# Altium schematic sheet USB.SchDoc
size A3; SheetNumber: 7; SheetTotal: 8; DocumentSheetName: USB Type-C UFP
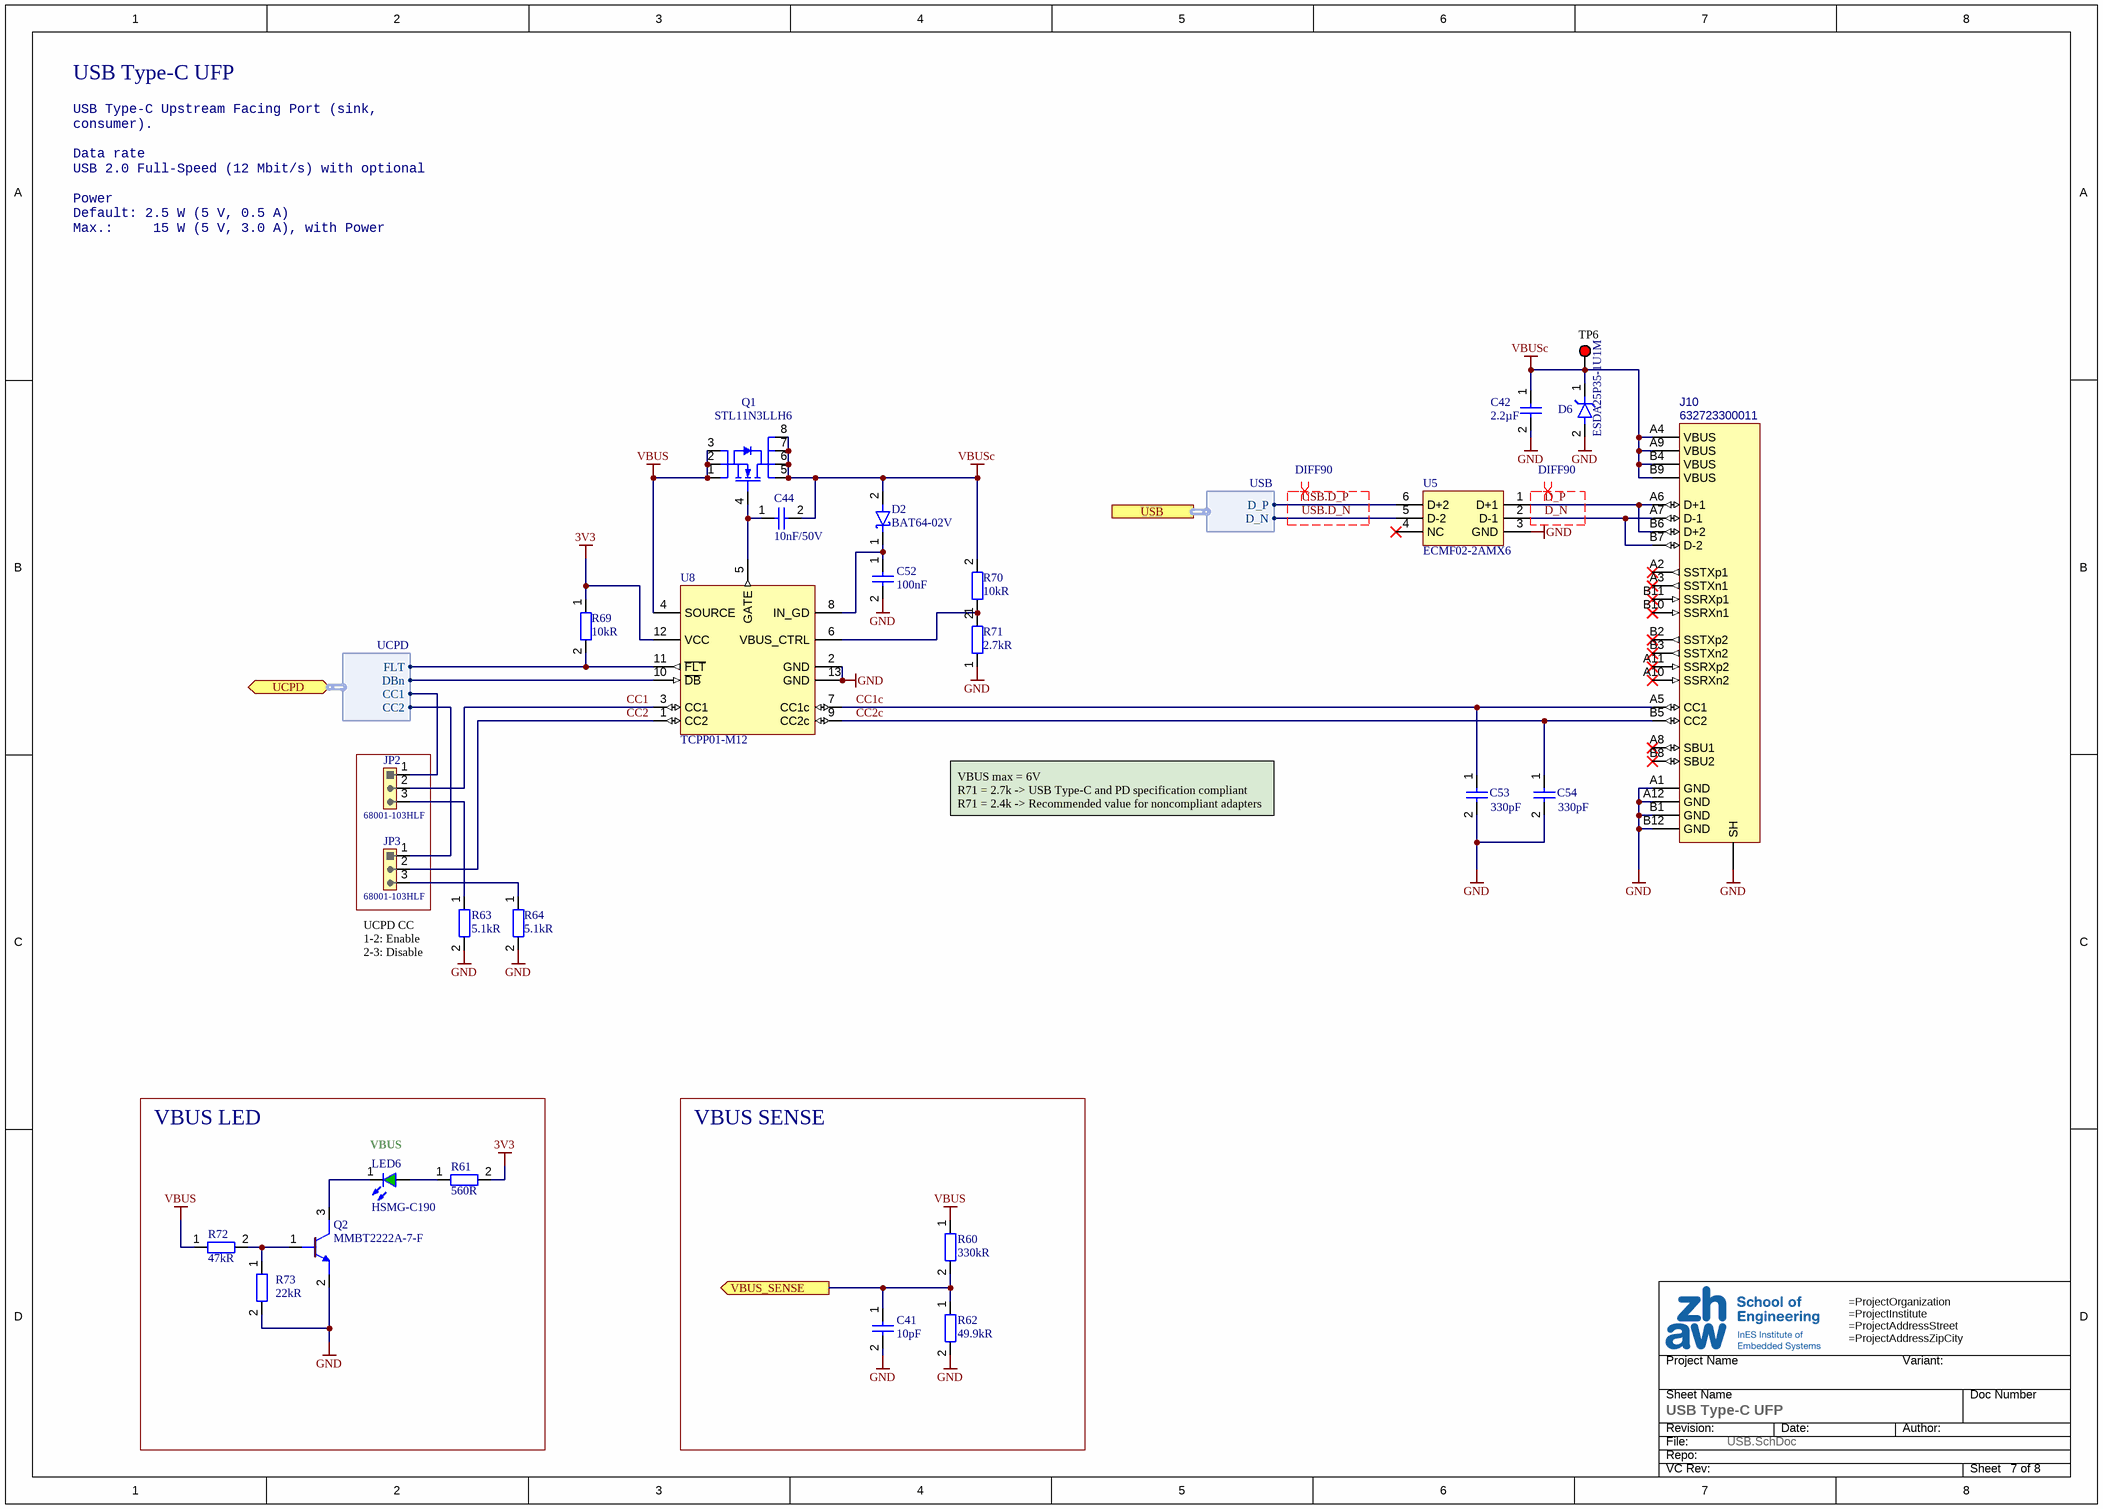
[diagram p0: USB.SchDoc]

## Parts
C41  value 10pF  [CAPC1608X80N]  (hidden comment: 10pF/50V)
C42  value 2.2µF  [CAPC1608X80N]  (hidden comment: 2.2uF/10V)
C44  10nF/50V  [CAPC1005X50N]
C52  value 100nF  [CAPC1608X80N]  (hidden comment: 100nF/50V)
C53  value 330pF  [CAPC1005X50N]  (hidden comment: 330pF/50V)
C54  value 330pF  [CAPC1005X50N]  (hidden comment: 330pF/50V)
D2  BAT64-02V  [SODFL160X65-2N]
D6  ESDA25P35-1U1M  [DFN110P160X60-2L]
J10  632723300011  [WE_632723300011]
JP2  68001-103HLF  [HD254_1x3_MV]
JP3  68001-103HLF  [HD254_1x3_MV]
LED6  HSMG-C190  [LEDSC160X80X80-2Lgn]
Q1  STL11N3LLH6  [PowerFLAT65P300X315X80-8+1]
Q2  MMBT2222A-7-F  [SOT95P235X120-3N]
R60  330kR  [RESC1608X45N]
R61  560R  [RESC1608X45N]
R62  49.9kR  [RESC1608X45N]
R63  5.1kR  [RESC1005X35N]
R64  5.1kR  [RESC1005X35N]
R69  10kR  [RESC1005X35N]
R70  10kR  [RESC1005X35N]
R71  2.7kR  [RESC1005X35N]
R72  47kR  [RESC1608X45N]
R73  22kR  [RESC1608X45N]
TP6  5000  [KSTN-5000]  (value not drawn)
U5  ECMF02-2AMX6  [QFN50P150X170X50-6N]
U8  TCPP01-M12  [QFN50P300X300X100-13T145X145N]

## Blocks framed on the sheet
VBUS LED: LED6 Q2 R61 R72 R73
VBUS SENSE: C41 R60 R62

## Ports
UCPD (bidir, harness UCPD), USB (harness USB), VBUS_SENSE (out)

## Harnesses
USB: D_P, D_N
UCPD: CC1, CC2, DBn, FLT

## Nets
3V3: R61.2 R69.1 U8.12(VCC)
GND: C41.2 C42.2 C52.2 C53.2 C54.2 D6.2(A) J10.A1(GND) J10.A12(GND) J10.B1(GND) J10.B12(GND) J10.SH Q2.2(E) R62.2 R63.2 R64.2 R71.1 R73.2 U5.3(GND) U8.2(GND) U8.13(GND)
VBUS: Q1.1(S) Q1.2(S) Q1.3(S) R60.1 R72.1 U8.4(SOURCE)
VBUSc: C42.1 C44.2 D2.2(Anode) D6.1(A) J10.A4(VBUS) J10.A9(VBUS) J10.B4(VBUS) J10.B9(VBUS) Q1.5(D) Q1.6(D) Q1.7(D) Q1.8(D) R70.2 TP6.1
CC1: JP2.2 U8.3(CC1)
CC1c: C53.1 J10.A5(CC1) U8.7(CC1c)
CC2: JP3.2 U8.1(CC2)
CC2c: C54.1 J10.B5(CC2) U8.9(CC2c)
D_N: J10.A7(D-1) J10.B7(D-2) U5.2(D-1)
D_P: J10.A6(D+1) J10.B6(D+2) U5.1(D+1)
USB.D_N: U5.5(D-2) ; port USB.D_N
USB.D_P: U5.6(D+2) ; port USB.D_P
VBUS_SENSE: C41.1 R60.2 R62.1 ; port VBUS_SENSE
NetC44_1: C44.1 Q1.4(G) U8.5(GATE)
NetC52_1: C52.1 D2.1(Cathode) U8.8(IN_GD)
NetJP2_1: JP2.1 ; port UCPD.CC1
NetJP2_3: JP2.3 R63.1
NetJP3_1: JP3.1 ; port UCPD.CC2
NetJP3_3: JP3.3 R64.1
NetLED6_1: LED6.1(K) Q2.3(C)
NetLED6_2: LED6.2(A) R61.1
NetQ2_1: Q2.1(B) R72.2 R73.1
NetR69_2: R69.2 U8.11(~{FLT}) ; port UCPD.FLT
NetR70_1: R70.1 R71.2 U8.6(VBUS_CTRL)
NetU8_10: U8.10(~{DB}) ; port UCPD.DBn

Not connected (* = marked no-connect by the designer): J10 A2(SSTXp1)* A3(SSTXn1)* A8(SBU1)* A10(SSRXn2)* A11(SSRXp2)* B2(SSTXp2)* B3(SSTXn2)* B8(SBU2)* B10(SSRXn1)* B11(SSRXp1)*; U5 4(NC)*

## Layout directives
differential pair; differential pair class DIFF90: D_N, D_P, USB.D_N, USB.D_P

## Notes on the sheet
- USB Type-C UFP
- USB Type-C Upstream Facing Port (sink, consumer).
  Data rate
  USB 2.0 Full-Speed (12 Mbit/s) with optional
  Power
  Default: 2.5 W (5 V, 0.5 A)
  Max.:     15 W (5 V, 3.0 A), with Power Delivery (PD)
- VBUS max = 6V
  R71 = 2.7k -> USB Type-C and PD specification compliant
  R71 = 2.4k -> Recommended value for noncompliant adapters
- (near R63) UCPD CC
  1-2: Enable
  2-3: Disable
- (near LED6) VBUS
- Sheet Name
- Project Name
- Variant:
- Doc Number
- File:
- Repo:
- Revision:
- Date:
- Author:
- VC Rev:
- Sheet

## Library data of the parts
C41 = CMP-001-00014-21: Cap MLCC, 10pF, 50V, C0G, 5%, 0603; Type: MLCC; Case/Package: 0603; Voltage Rating: 50V; Case Code (Metric): 1608; Mounting Technology: SMD; Tolerance: 5%; Dielectricum: C0G
C42 = CMP-00353-4: Cap MLCC, 2.2uF, 10V, X7R, 10%, 0603; Case Code (Metric): 1608; Case/Package: 0603; Tolerance: 10%; Mounting Technology: SMD; Type: MLCC; Dielectricum: X7R; Voltage Rating: 10V
C44 = CMP-001-00069-21: Cap MLCC, 10nF, 50V, X7R, 10%, 0402; Tolerance: 10%; Type: MLCC; Voltage Rating: 50V; Case Code (Metric): 1005; Mounting Technology: SMD; Case/Package: 0402; Dielectricum: X7R; Value: 10nF
C52 = CMP-001-00017-21: Cap MLCC, 100nF, 50V, X7R, 10%, 0603; Voltage Rating: 50V; Dielectricum: X7R; Tolerance: 10%; Type: MLCC; Mounting Technology: SMD; Case Code (Metric): 1608; Case/Package: 0603
C53 C54 = CMP-001-00094-19: Cap MLCC, 330pF, 50V, C0G, 5%, 0402; Type: MLCC; Dielectricum: C0G; Voltage Rating: 50V; Case/Package: 0402; Mounting Technology: SMD; Tolerance: 5%; Case Code (Metric): 1005
D2 = CMP-004-00068-26: Schottky Diode, 40V, 250mA, SOD-523FL-2; Type: SOD123; Voltage: 40V; Current: 250mA; Mounting Technology: SMD; Case/Package: SOD-523FL-2
D6 = CMP-004-00023-26: TVS Diode, unidirectional, 22V, 35A, 1400W, 1610 (0603); Peak Power: 1.4kW; Connection: single; Size: L1.6B1H0.55; Peak Current: 35A; Rated Voltage: 22V; Direction: unidirectional; Case Code (Metric): 1610; Case/Package: 0603; Mounting Technology: SMD
J10 = CMP-220-000000-8: USB-C, 24 Pin, Pitch 500um, 20V, Horizontal, SMD/THT, L11.2B8.74H2.96; Manufacturer: Wurth Elektronik; Pitch: 500µm; Max Current: 5A; Gender: Female; Connection: Pluggable; Pin Mapping: 2x12; Family Name: WR-USB Connectors; Mounting Technology: SMD/THT; Angle: Horizontal; Type: USB-C; Pins: 24; Max Voltage: 20V; Size: L11.2B8.74H2.96
JP2 JP3 = CMP-002-00127-12: Header, 1x3 Pin, Pitch 2.54mm, Male, Vertical, THT; Manufacturer: FCI; Mating Length: 5.84mm; Plating: Gold; Overall Contact Length: 11.43mm; Termination Length: 3.05mm; Pitch Row: 2.54mm; Pin Mapping: 1x3; Pins: 3; Mounting Technology: THT; Angle: Vertical; Pitch: 2.54mm; Insulation Height: 2.54mm; Gender: Male
LED6 = CMP-007-00013-24: LED, Green, 20mA, 2.2V, 0603; Case/Package: 0603; Rated Current: 20mA; Forward Voltage: 2.2V; Size: L1.6B0.8H0.8; Color: Green; Mounting Technology: SMD
Q1 = CMP-00725-7: MOSFET N-enh, 30V, 11A, 44Ap, 6mR, 50W, PowerFLAT 3.3 x 3.3; Resistance: 6m; Current peak: 44A; Type: MOSFET; Power: 50W; Case/Package: PowerFLAT 3.3 x 3.3; Mounting Technology: SMD; Current: 11A; Technology: N-enhancement; Voltage: 30V; Size: L3.15B3.0H0.8
Q2 = CMP-013-00084-8: Transistor NPN, 40V, 600mA, 310mW, SOT-23-3; Current: 600mA; Case/Package: SOT-23-3; Voltage: 40V; Power: 310mW; Type: Transistor; Mounting Technology: SMD; Technology: NPN
R60 = CMP-009-00448-5: Res, 330kR, 1%, 0.1W, 0603; Value: 330k; Voltage Rating: 75V; Power: 100mW; Temperature Coefficient: 100ppm; Case/Package: 0603; Type: Fixed; Case Code (Metric): 1608; Tolerance: 1%; Mounting Technology: SMD
R61 = CMP-00862-1: Res, 560R, 1%, 100mW, 0603; Voltage Rating: 75V; Value: 560; Tolerance: 1%; Case/Package: 0603; Mounting Technology: SMD; Type: Fixed; Power: 100mW; Case Code (Metric): 1608
R62 = CMP-00778-2: Res, 49.9kR, 1%, 100mW, 0603; Value: 49.9k; Voltage Rating: 75V; Temperature Coefficient: 100ppm; Case Code (Metric): 1608; Power: 100mW; Case/Package: 0603; Tolerance: 1%; Type: Fixed; Size: L1.6B0.8H0.45; Mounting Technology: SMD
R63 R64 = CMP-009-00255-13: Res, 5.1kR, 1%, 0.063W, 0402; Voltage Rating: 50V; Value: 5.1k; Power: 63mW; Case/Package: 0402; Case Code (Metric): 1005; Tolerance: 1%; Mounting Technology: SMD; Type: Fixed
R69 R70 = CMP-009-00298-12: Res, 10kR, 1%, 0.063W, 0402; Value: 10k; Power: 63mW; Voltage Rating: 50V; Tolerance: 1%; Type: Fixed; Case Code (Metric): 1005; Case/Package: 0402; Mounting Technology: SMD
R71 = CMP-009-00214-21: Res, 2.7kR, 1%, 0.063W, 0402; Value: 2.7k; Power: 63mW; Voltage Rating: 50V; Type: Fixed; Mounting Technology: SMD; Case/Package: 0402; Case Code (Metric): 1005; Tolerance: 1%
R72 = CMP-009-00436-5: Res, 47kR, 1%, 0.1W, 0603; Voltage Rating: 75V; Temperature Coefficient: 100ppm/°C; Power: 100mW; Value: 47k; Case/Package: 0603; Case Code (Metric): 1608; Mounting Technology: SMD; Type: Fixed; Tolerance: 1%
R73 = CMP-009-00438-5: Res, 22kR, 1%, 0.1W, 0603; Voltage Rating: 75V; Temperature Coefficient: 100ppm; Value: 22k; Power: 100mW; Tolerance: 1%; Case Code (Metric): 1608; Mounting Technology: SMD; Type: Fixed; Case/Package: 0603
TP6 = CMP-00067-9: Test Point, Red, D2.5H4.6, THT, closed ring D1.25; Mounting Technology: THT; Color: Red; Size: D2.5H4.6
U5 = CMP-00721-6: ESD Common Mode Filter, Diodes and CM-Chocke, 6Vbr, 1.8ohm, 8kVpp, uQFN-6L, USB 2.0, MIPI D-PHY/MDDI; Specification: 6Vbr, 1.8ohm, 8kVpp; Type: ESD Common Mode Filter; Size: L1.7B1.5H0.5; Case/Package: uQFN-6L; Mounting Technology: SMD; Connection: Diodes and CM-Chocke
U8 = CMP-00861-5: USB Type-C and Power Delivery Protection, 2.7...22V, QFN-12; Max Supply Voltage: 22V; Min Supply Voltage: 2.7V; Case/Package: QFN-12; Mounting Technology: SMD; Function: USB Type-C and Power Delivery Protection; Size: L3.00B3.00H0.90